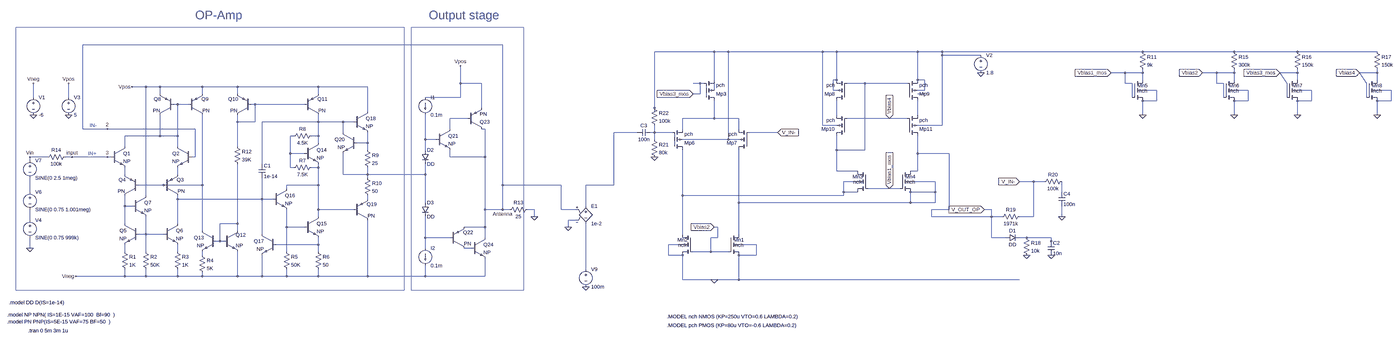
[diagram p0: schematic d (2).asc, whole sheet]
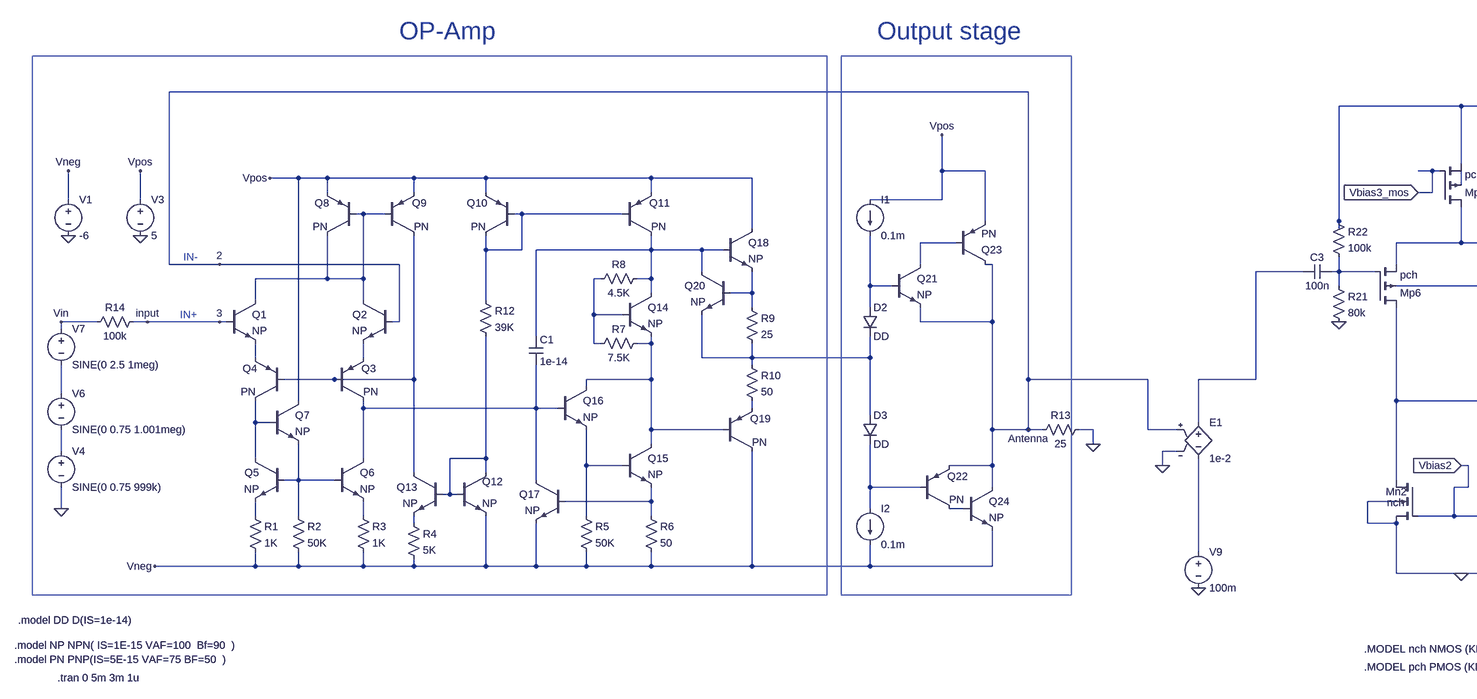
[diagram p1: schematic d (2).asc, part, row 1 of 1, column 1 of 2]
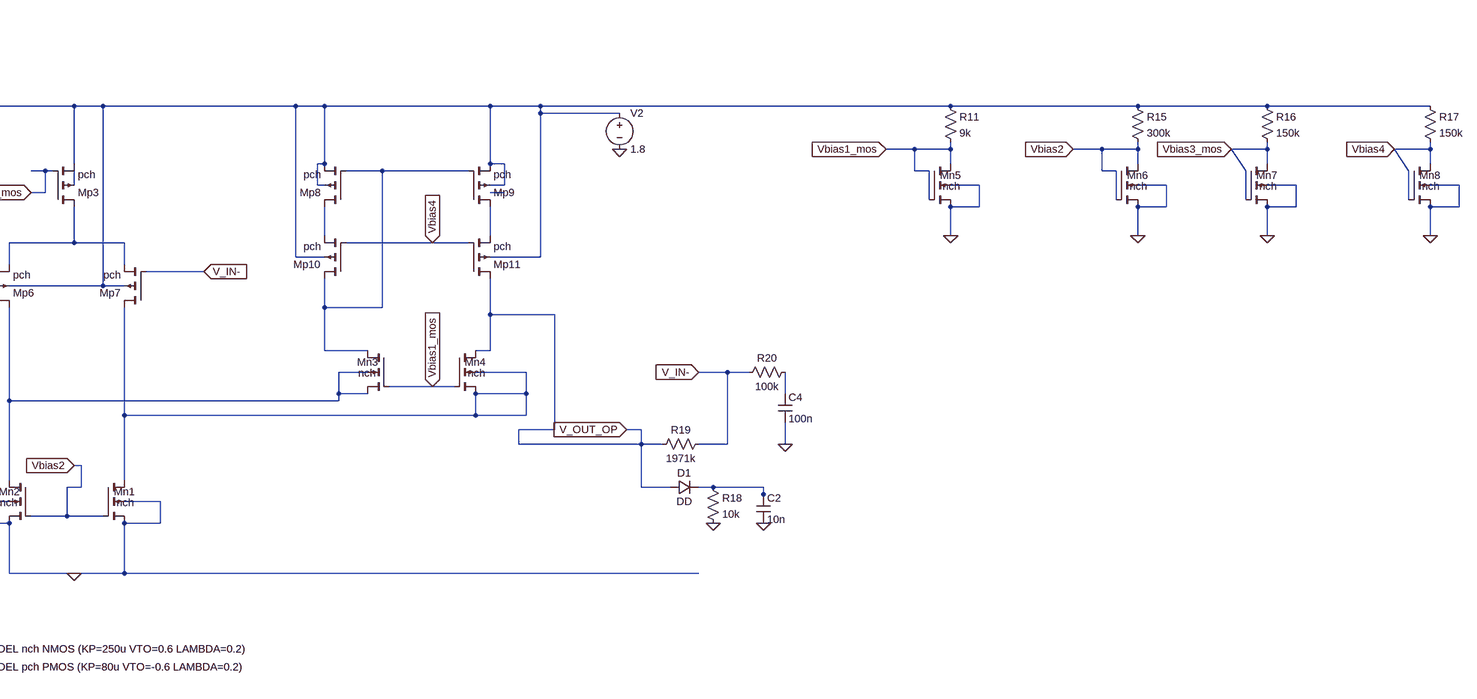
[diagram p2: schematic d (2).asc, part, row 1 of 1, column 2 of 2]
d (2).asc, the LTspice schematic file:
Version 4
SHEET 1 11364 3732
WIRE 2192 -1040 240 -1040
WIRE 3456 -1008 3184 -1008
WIRE 3520 -1008 3456 -1008
WIRE 3952 -1008 3520 -1008
WIRE 4016 -1008 3952 -1008
WIRE 4384 -1008 4016 -1008
WIRE 4496 -1008 4384 -1008
WIRE 5408 -1008 4496 -1008
WIRE 5824 -1008 5408 -1008
WIRE 6112 -1008 5824 -1008
WIRE 6496 -1008 6112 -1008
WIRE 4496 -992 4496 -1008
WIRE 4672 -992 4496 -992
WIRE 5328 -912 5264 -912
WIRE 5408 -912 5408 -928
WIRE 5408 -912 5328 -912
WIRE 5744 -912 5680 -912
WIRE 5824 -912 5824 -928
WIRE 5824 -912 5744 -912
WIRE 6112 -912 6112 -928
WIRE 6112 -912 6032 -912
WIRE 6496 -912 6496 -928
WIRE 6496 -912 6416 -912
WIRE 3456 -880 3456 -1008
WIRE 4016 -880 4016 -1008
WIRE 4016 -880 4000 -880
WIRE 4384 -880 4384 -1008
WIRE 4416 -880 4384 -880
WIRE 5408 -880 5408 -912
WIRE 5824 -880 5824 -912
WIRE 6112 -880 6112 -912
WIRE 6496 -880 6496 -912
WIRE 2000 -864 2000 -944
WIRE 2096 -864 2000 -864
WIRE 3392 -864 3360 -864
WIRE 3408 -864 3392 -864
WIRE 4144 -864 4064 -864
WIRE 4336 -864 4144 -864
WIRE 5328 -864 5328 -912
WIRE 5360 -864 5328 -864
WIRE 5744 -864 5744 -912
WIRE 5776 -864 5744 -864
WIRE 6064 -864 6032 -912
WIRE 6448 -864 6416 -912
WIRE 528 -848 464 -848
WIRE 592 -848 528 -848
WIRE 784 -848 592 -848
WIRE 944 -848 784 -848
WIRE 1312 -848 944 -848
WIRE 1536 -848 1312 -848
WIRE 3456 -832 3456 -864
WIRE 4000 -832 4000 -880
WIRE 4016 -832 4000 -832
WIRE 4416 -832 4416 -880
WIRE 4416 -832 4384 -832
WIRE 5472 -832 5408 -832
WIRE 5888 -832 5824 -832
WIRE 6176 -832 6112 -832
WIRE 6560 -832 6496 -832
WIRE 592 -816 592 -848
WIRE 784 -816 784 -848
WIRE 944 -816 944 -848
WIRE 1312 -816 1312 -848
WIRE 3392 -816 3392 -864
WIRE 3392 -816 3360 -816
WIRE 4416 -816 4384 -816
WIRE 16 -800 16 -864
WIRE 176 -800 176 -864
WIRE 2000 -800 2000 -864
WIRE 2000 -800 1840 -800
WIRE 5360 -800 5360 -864
WIRE 5776 -800 5776 -864
WIRE 6064 -800 6064 -864
WIRE 6448 -800 6448 -864
WIRE 5472 -784 5472 -832
WIRE 5472 -784 5408 -784
WIRE 5888 -784 5888 -832
WIRE 5888 -784 5824 -784
WIRE 6176 -784 6176 -832
WIRE 6176 -784 6112 -784
WIRE 6560 -784 6560 -832
WIRE 6560 -784 6496 -784
WIRE 672 -768 656 -768
WIRE 720 -768 672 -768
WIRE 1024 -768 1008 -768
WIRE 1248 -768 1024 -768
WIRE 2096 -752 2096 -864
WIRE 3184 -752 3184 -1008
WIRE 1536 -736 1536 -848
WIRE 3184 -736 3184 -752
WIRE 4016 -720 4016 -784
WIRE 4384 -720 4384 -784
WIRE 5408 -720 5408 -784
WIRE 5824 -720 5824 -784
WIRE 6112 -720 6112 -784
WIRE 6496 -720 6496 -784
WIRE 2032 -704 1952 -704
WIRE 3456 -704 3456 -784
WIRE 3456 -704 3312 -704
WIRE 3568 -704 3456 -704
WIRE 4256 -704 4064 -704
WIRE 4336 -704 4256 -704
WIRE 944 -688 944 -720
WIRE 1024 -688 1024 -768
WIRE 1024 -688 944 -688
WIRE 1312 -688 1312 -720
WIRE 1312 -688 1056 -688
WIRE 1424 -688 1312 -688
WIRE 1472 -688 1424 -688
WIRE 3952 -672 3952 -1008
WIRE 4016 -672 3952 -672
WIRE 4496 -672 4496 -992
WIRE 4496 -672 4384 -672
WIRE 240 -656 240 -1040
WIRE 352 -656 240 -656
WIRE 752 -656 352 -656
WIRE 1952 -656 1952 -704
WIRE 2112 -656 2096 -656
WIRE 3312 -656 3312 -704
WIRE 3568 -656 3568 -704
WIRE 1424 -640 1424 -688
WIRE 3104 -640 2768 -640
WIRE 3184 -640 3184 -672
WIRE 3184 -640 3168 -640
WIRE 3264 -640 3184 -640
WIRE 3744 -640 3616 -640
WIRE 592 -624 592 -720
WIRE 592 -624 432 -624
WIRE 672 -624 672 -768
WIRE 672 -624 592 -624
WIRE 1200 -624 1184 -624
WIRE 1312 -624 1312 -688
WIRE 1312 -624 1280 -624
WIRE 1840 -608 1840 -720
WIRE 1888 -608 1840 -608
WIRE 3184 -608 3184 -640
WIRE 3520 -608 3520 -1008
WIRE 3520 -608 3312 -608
WIRE 3568 -608 3520 -608
WIRE 1312 -592 1312 -624
WIRE 1536 -592 1536 -640
WIRE 1536 -592 1488 -592
WIRE 432 -576 432 -624
WIRE 672 -576 672 -624
WIRE 944 -576 944 -688
WIRE 1536 -560 1536 -592
WIRE 1840 -560 1840 -608
WIRE 4016 -560 4016 -624
WIRE 4144 -560 4144 -864
WIRE 4144 -560 4016 -560
WIRE 1184 -544 1184 -624
WIRE 1248 -544 1184 -544
WIRE 4384 -544 4384 -624
WIRE 4528 -544 4384 -544
WIRE 80 -528 0 -528
WIRE 192 -528 160 -528
WIRE 352 -528 192 -528
WIRE 368 -528 352 -528
WIRE 752 -528 752 -656
WIRE 752 -528 736 -528
WIRE 1952 -528 1952 -560
WIRE 2112 -528 2112 -656
WIRE 2112 -528 1952 -528
WIRE 0 -512 0 -528
WIRE 1056 -496 1056 -688
WIRE 1184 -480 1184 -544
WIRE 1200 -480 1184 -480
WIRE 1312 -480 1312 -496
WIRE 1312 -480 1280 -480
WIRE 4016 -464 4016 -560
WIRE 4112 -464 4016 -464
WIRE 4384 -464 4384 -544
WIRE 4384 -464 4352 -464
WIRE 432 -448 432 -480
WIRE 672 -448 672 -480
WIRE 1424 -448 1424 -544
WIRE 1536 -448 1536 -480
WIRE 1536 -448 1424 -448
WIRE 1840 -448 1840 -496
WIRE 1840 -448 1536 -448
WIRE 1536 -432 1536 -448
WIRE 4112 -416 4048 -416
WIRE 4464 -416 4352 -416
WIRE 4912 -416 4848 -416
WIRE 4960 -416 4912 -416
WIRE 608 -400 496 -400
WIRE 784 -400 784 -720
WIRE 784 -400 608 -400
WIRE 1312 -400 1312 -480
WIRE 1312 -400 1168 -400
WIRE 2192 -400 2192 -1040
WIRE 2528 -400 2192 -400
WIRE 2768 -400 2768 -640
WIRE 2768 -400 2640 -400
WIRE 1168 -384 1168 -400
WIRE 4256 -384 4160 -384
WIRE 4304 -384 4256 -384
WIRE 0 -368 0 -432
WIRE 4048 -368 4048 -416
WIRE 4112 -368 4048 -368
WIRE 4464 -368 4464 -416
WIRE 4464 -368 4352 -368
WIRE 5040 -368 5040 -416
WIRE 528 -352 528 -848
WIRE 3312 -352 3312 -560
WIRE 4048 -352 4048 -368
WIRE 4048 -352 3312 -352
WIRE 672 -336 672 -352
WIRE 1056 -336 1056 -432
WIRE 1056 -336 672 -336
WIRE 1104 -336 1056 -336
WIRE 1536 -336 1536 -352
WIRE 1840 -320 1840 -448
WIRE 3568 -320 3568 -560
WIRE 4352 -320 4352 -368
WIRE 4352 -320 3568 -320
WIRE 4464 -320 4464 -368
WIRE 4464 -320 4352 -320
WIRE 432 -304 432 -352
WIRE 464 -304 432 -304
WIRE 2640 -304 2640 -400
WIRE 1312 -288 1312 -400
WIRE 1472 -288 1312 -288
WIRE 2112 -288 2112 -528
WIRE 2192 -288 2192 -400
WIRE 2192 -288 2112 -288
WIRE 2224 -288 2192 -288
WIRE 2336 -288 2304 -288
WIRE 2528 -288 2528 -400
WIRE 2592 -288 2528 -288
WIRE 4528 -288 4528 -544
WIRE 4528 -288 4448 -288
WIRE 4720 -288 4688 -288
WIRE 1312 -256 1312 -288
WIRE 2336 -256 2336 -288
WIRE 4448 -256 4448 -288
WIRE 4720 -256 4720 -288
WIRE 4720 -256 4448 -256
WIRE 4768 -256 4720 -256
WIRE 4912 -256 4912 -416
WIRE 4912 -256 4848 -256
WIRE 5040 -256 5040 -304
WIRE 0 -240 0 -288
WIRE 2592 -240 2560 -240
WIRE 432 -224 432 -304
WIRE 672 -224 672 -336
WIRE 944 -224 944 -496
WIRE 944 -224 864 -224
WIRE 1168 -208 1168 -288
WIRE 1248 -208 1168 -208
WIRE 2112 -208 2112 -288
WIRE 2112 -208 2016 -208
WIRE 2560 -208 2560 -240
WIRE 3472 -208 3456 -208
WIRE 784 -192 784 -400
WIRE 944 -192 944 -224
WIRE 528 -176 528 -256
WIRE 528 -176 496 -176
WIRE 608 -176 528 -176
WIRE 1056 -176 1056 -336
WIRE 3312 -176 3312 -352
WIRE 3568 -176 3568 -320
WIRE 1840 -160 1840 -256
WIRE 1952 -160 1840 -160
WIRE 2112 -160 2112 -208
WIRE 3472 -160 3472 -208
WIRE 3472 -160 3440 -160
WIRE 4720 -160 4720 -256
WIRE 4784 -160 4720 -160
WIRE 4880 -160 4848 -160
WIRE 4992 -160 4880 -160
WIRE 864 -144 864 -224
WIRE 864 -144 848 -144
WIRE 880 -144 864 -144
WIRE 4992 -144 4992 -160
WIRE 1312 -128 1312 -160
WIRE 1312 -128 1120 -128
WIRE 3312 -128 3248 -128
WIRE 3648 -128 3568 -128
WIRE 4992 -128 4992 -144
WIRE 0 -112 0 -160
WIRE 1840 -112 1840 -160
WIRE 2048 -112 2016 -112
WIRE 432 -96 432 -128
WIRE 528 -96 528 -176
WIRE 672 -96 672 -128
WIRE 1168 -96 1168 -208
WIRE 1312 -96 1312 -128
WIRE 3440 -96 3440 -160
WIRE 3440 -96 3360 -96
WIRE 3520 -96 3440 -96
WIRE 784 -80 784 -96
WIRE 3248 -80 3248 -128
WIRE 3312 -80 3248 -80
WIRE 3648 -80 3648 -128
WIRE 3648 -80 3568 -80
WIRE 2640 -16 2640 -224
WIRE 432 16 432 -16
WIRE 432 16 208 16
WIRE 528 16 528 -16
WIRE 528 16 432 16
WIRE 672 16 672 -16
WIRE 672 16 528 16
WIRE 784 16 784 0
WIRE 784 16 672 16
WIRE 944 16 944 -96
WIRE 944 16 784 16
WIRE 1056 16 1056 -80
WIRE 1056 16 944 16
WIRE 1168 16 1168 -16
WIRE 1168 16 1056 16
WIRE 1312 16 1312 -16
WIRE 1312 16 1168 16
WIRE 1536 16 1536 -240
WIRE 1536 16 1312 16
WIRE 1840 16 1840 -32
WIRE 1840 16 1536 16
WIRE 2112 16 2112 -64
WIRE 2112 16 1840 16
WIRE 3312 32 3312 -80
WIRE 3456 32 3312 32
WIRE 3568 32 3568 -80
WIRE 3568 32 3456 32
WIRE 4848 32 3568 32
FLAG 352 -528 3
FLAG 352 -656 2
FLAG 16 -720 0
FLAG 176 -720 0
FLAG 176 -864 Vpos
FLAG 16 -864 Vneg
FLAG 0 -112 0
FLAG 2000 -944 Vpos
FLAG 2336 -256 0
FLAG 464 -848 Vpos
FLAG 208 16 Vneg
FLAG 192 -528 input
FLAG 2192 -288 Antenna
FLAG 2640 64 0
FLAG 2560 -208 0
FLAG 3456 32 0
FLAG 3456 -208 Vbias2
IOPIN 3456 -208 In
FLAG 3744 -640 V_IN-
IOPIN 3744 -640 In
FLAG 4672 -912 0
FLAG 4848 -416 V_IN-
IOPIN 4848 -416 In
FLAG 5040 -256 0
FLAG 4688 -288 V_OUT_OP
IOPIN 4688 -288 In
FLAG 3184 -528 0
FLAG 5408 -720 0
FLAG 3360 -816 Vbias3_mos
IOPIN 3360 -816 In
FLAG 5264 -912 Vbias1_mos
IOPIN 5264 -912 In
FLAG 4256 -384 Vbias1_mos
IOPIN 4256 -384 In
FLAG 5824 -720 0
FLAG 5680 -912 Vbias2
IOPIN 5680 -912 In
FLAG 6112 -720 0
FLAG 6032 -912 Vbias3_mos
IOPIN 6032 -912 In
FLAG 6496 -720 0
FLAG 6416 -912 Vbias4
IOPIN 6416 -912 In
FLAG 4256 -704 Vbias4
IOPIN 4256 -704 In
FLAG 4880 -80 0
FLAG 4992 -80 0
FLAG 0 -528 Vin
SYMBOL NPN 368 -576 R0
SYMATTR InstName Q1
SYMATTR Value NP
SYMBOL npn 736 -576 M0
SYMATTR InstName Q2
SYMATTR Value NP
SYMBOL PNP 608 -352 M180
WINDOW 0 60 72 Left 2
WINDOW 3 64 20 Left 2
SYMATTR InstName Q3
SYMATTR Value PN
SYMBOL pnp 496 -352 R180
WINDOW 0 60 72 Left 2
WINDOW 3 64 20 Left 2
SYMATTR InstName Q4
SYMATTR Value PN
SYMBOL npn 496 -224 M0
SYMATTR InstName Q5
SYMATTR Value NP
SYMBOL npn 608 -224 R0
SYMATTR InstName Q6
SYMATTR Value NP
SYMBOL npn 464 -352 R0
SYMATTR InstName Q7
SYMATTR Value NP
SYMBOL pnp 656 -720 R180
WINDOW 0 60 72 Left 2
WINDOW 3 64 20 Left 2
SYMATTR InstName Q8
SYMATTR Value PN
SYMBOL RES 416 -112 R0
SYMATTR InstName R1
SYMATTR Value 1K
SYMBOL res 512 -112 R0
SYMATTR InstName R2
SYMATTR Value 50K
SYMBOL res 656 -112 R0
SYMATTR InstName R3
SYMATTR Value 1K
SYMBOL pnp 720 -720 M180
WINDOW 0 60 72 Left 2
WINDOW 3 64 20 Left 2
SYMATTR InstName Q9
SYMATTR Value PN
SYMBOL pnp 1008 -720 R180
WINDOW 0 60 72 Left 2
WINDOW 3 64 20 Left 2
SYMATTR InstName Q10
SYMATTR Value PN
SYMBOL pnp 1248 -720 M180
WINDOW 0 60 72 Left 2
WINDOW 3 64 20 Left 2
SYMATTR InstName Q11
SYMATTR Value PN
SYMBOL npn 880 -192 R0
WINDOW 0 56 20 Left 2
SYMATTR InstName Q12
SYMATTR Value NP
SYMBOL npn 848 -192 M0
SYMATTR InstName Q13
SYMATTR Value NP
SYMBOL res 768 -96 R0
SYMATTR InstName R4
SYMATTR Value 5K
SYMBOL npn 1248 -592 R0
SYMATTR InstName Q14
SYMATTR Value NP
SYMBOL npn 1248 -256 R0
SYMATTR InstName Q15
SYMATTR Value NP
SYMBOL npn 1104 -384 R0
SYMATTR InstName Q16
SYMATTR Value NP
SYMBOL res 1152 -112 R0
SYMATTR InstName R5
SYMATTR Value 50K
SYMBOL res 1296 -112 R0
SYMATTR InstName R6
SYMATTR Value 50
SYMBOL npn 1120 -176 M0
SYMATTR InstName Q17
SYMATTR Value NP
SYMBOL cap 1040 -496 R0
SYMATTR InstName C1
SYMATTR Value 1e-14
SYMBOL res 1296 -496 R90
WINDOW 0 0 56 VBottom 2
WINDOW 3 32 56 VTop 2
SYMATTR InstName R7
SYMATTR Value 7.5K
SYMBOL res 1296 -640 R90
WINDOW 0 0 56 VBottom 2
WINDOW 3 32 56 VTop 2
SYMATTR InstName R8
SYMATTR Value 4.5K
SYMBOL npn 1472 -736 R0
SYMATTR InstName Q18
SYMATTR Value NP
SYMBOL pnp 1472 -240 M180
WINDOW 0 60 72 Left 2
WINDOW 3 64 20 Left 2
SYMATTR InstName Q19
SYMATTR Value PN
SYMBOL res 1520 -576 R0
SYMATTR InstName R9
SYMATTR Value 25
SYMBOL res 1520 -448 R0
SYMATTR InstName R10
SYMATTR Value 50
SYMBOL npn 1488 -640 M0
SYMATTR InstName Q20
SYMATTR Value NP
SYMBOL res 928 -592 R0
SYMATTR InstName R12
SYMATTR Value 39K
SYMBOL voltage 16 -816 R0
WINDOW 123 0 0 Left 0
WINDOW 39 0 0 Left 0
SYMATTR InstName V1
SYMATTR Value -6
SYMBOL voltage 176 -816 R0
WINDOW 123 0 0 Left 0
WINDOW 39 0 0 Left 0
SYMATTR InstName V3
SYMATTR Value 5
SYMBOL voltage 0 -256 R0
WINDOW 123 0 0 Left 0
WINDOW 39 0 0 Left 0
SYMATTR InstName V4
SYMATTR Value SINE(0 0.75 999k)
SYMBOL voltage 0 -384 R0
WINDOW 123 0 0 Left 0
WINDOW 39 0 0 Left 0
SYMATTR InstName V6
SYMATTR Value SINE(0 0.75 1.001meg)
SYMBOL voltage 0 -528 R0
WINDOW 123 0 0 Left 0
WINDOW 39 0 0 Left 0
SYMATTR InstName V7
SYMATTR Value SINE(0 2.5 1meg)
SYMBOL PNP 1952 -112 M180
WINDOW 0 60 72 Left 2
WINDOW 3 64 20 Left 2
SYMATTR InstName Q22
SYMATTR Value PN
SYMBOL NPN 2048 -160 R0
SYMATTR InstName Q24
SYMATTR Value NP
SYMBOL res 2320 -304 R90
WINDOW 0 0 56 VBottom 2
WINDOW 3 32 56 VTop 2
SYMATTR InstName R13
SYMATTR Value 25
SYMBOL e 2640 -320 R0
SYMATTR InstName E1
SYMATTR Value 1e-2
SYMBOL voltage 2640 -32 R0
WINDOW 123 0 0 Left 0
WINDOW 39 0 0 Left 0
SYMATTR InstName V9
SYMATTR Value 100m
SYMBOL res 176 -544 R90
WINDOW 0 0 56 VBottom 2
WINDOW 3 32 56 VTop 2
SYMATTR InstName R14
SYMATTR Value 100k
SYMBOL pmos4 3408 -784 M180
SYMATTR InstName Mp3
SYMATTR Value pch
SYMATTR Value2 l=2u w=10u m=1
SYMBOL pmos4 3264 -560 M180
SYMATTR InstName Mp6
SYMATTR Value pch
SYMATTR Value2 l=0.8u w=300u m=20
SYMBOL pmos4 3616 -560 R180
SYMATTR InstName Mp7
SYMATTR Value pch
SYMATTR Value2 l=0.8u w=300u m=20
SYMBOL nmos4 3520 -176 R0
WINDOW 0 24 26 Left 2
WINDOW 3 30 50 Left 2
SYMATTR InstName Mn1
SYMATTR Value nch
SYMATTR Value2 l=0.8u w=430u m=10
SYMBOL nmos4 3360 -176 M0
WINDOW 0 24 26 Left 2
WINDOW 3 30 50 Left 2
SYMATTR InstName Mn2
SYMATTR Value nch
SYMATTR Value2 l=0.8u w=430u m=10
SYMBOL pmos4 4064 -784 R180
SYMATTR InstName Mp8
SYMATTR Value pch
SYMATTR Value2 l=0.8u w=550u m=1
SYMBOL pmos4 4336 -784 M180
SYMATTR InstName Mp9
SYMATTR Value pch
SYMATTR Value2 l=0.8u w=550u m=1
SYMBOL pmos4 4064 -624 R180
SYMATTR InstName Mp10
SYMATTR Value pch
SYMATTR Value2 l=0.8u w=550u m=1
SYMBOL pmos4 4336 -624 M180
SYMATTR InstName Mp11
SYMATTR Value pch
SYMATTR Value2 l=0.8u w=550u m=1
SYMBOL nmos4 4160 -464 M0
WINDOW 0 24 26 Left 2
WINDOW 3 30 50 Left 2
SYMATTR InstName Mn3
SYMATTR Value nch
SYMATTR Value2 l=2u w=100u m=1
SYMBOL nmos4 4304 -464 R0
WINDOW 0 24 26 Left 2
WINDOW 3 30 50 Left 2
SYMATTR InstName Mn4
SYMATTR Value nch
SYMATTR Value2 l=2u w=100u m=1
SYMBOL voltage 4672 -1008 R0
WINDOW 123 0 0 Left 0
WINDOW 39 0 0 Left 0
SYMATTR InstName V2
SYMATTR Value 1.8
SYMBOL res 4864 -272 R90
WINDOW 0 0 56 VBottom 2
WINDOW 3 32 56 VTop 2
SYMATTR InstName R19
SYMATTR Value 1971k
SYMBOL res 4944 -400 R270
WINDOW 0 32 56 VTop 2
WINDOW 3 0 56 VBottom 2
SYMATTR InstName R20
SYMATTR Value 100k
SYMBOL res 3168 -624 R0
SYMATTR InstName R21
SYMATTR Value 80k
SYMBOL res 3168 -768 R0
SYMATTR InstName R22
SYMATTR Value 100k
SYMBOL cap 3168 -656 R90
WINDOW 0 0 32 VBottom 2
WINDOW 3 32 32 VTop 2
SYMATTR InstName C3
SYMATTR Value 100n
SYMBOL cap 5024 -368 R0
SYMATTR InstName C4
SYMATTR Value 100n
SYMBOL res 5392 -1024 R0
SYMATTR InstName R11
SYMATTR Value 9k
SYMBOL nmos4 5360 -880 R0
WINDOW 0 24 26 Left 2
WINDOW 3 30 50 Left 2
SYMATTR InstName Mn5
SYMATTR Value nch
SYMATTR Value2 l=1u w=1u m=1
SYMBOL res 5808 -1024 R0
SYMATTR InstName R15
SYMATTR Value 300k
SYMBOL nmos4 5776 -880 R0
WINDOW 0 24 26 Left 2
WINDOW 3 30 50 Left 2
SYMATTR InstName Mn6
SYMATTR Value nch
SYMATTR Value2 l=1u w=200u m=3
SYMBOL res 6096 -1024 R0
SYMATTR InstName R16
SYMATTR Value 150k
SYMBOL nmos4 6064 -880 R0
WINDOW 0 24 26 Left 2
WINDOW 3 30 50 Left 2
SYMATTR InstName Mn7
SYMATTR Value nch
SYMATTR Value2 l=1u w=1u m=1
SYMBOL res 6480 -1024 R0
SYMATTR InstName R17
SYMATTR Value 150k
SYMBOL nmos4 6448 -880 R0
WINDOW 0 24 26 Left 2
WINDOW 3 30 50 Left 2
SYMATTR InstName Mn8
SYMATTR Value nch
SYMATTR Value2 l=1u w=1u m=1
SYMBOL res 4864 -176 R0
SYMATTR InstName R18
SYMATTR Value 10k
SYMBOL cap 4976 -144 R0
SYMATTR InstName C2
SYMATTR Value 10n
SYMBOL diode 4784 -144 R270
WINDOW 0 32 32 VTop 2
WINDOW 3 0 32 VBottom 2
SYMATTR InstName D1
SYMATTR Value DD
SYMBOL npn 1888 -656 R0
SYMATTR InstName Q21
SYMATTR Value NP
SYMBOL pnp 2032 -656 M180
SYMATTR InstName Q23
SYMATTR Value PN
SYMBOL current 1840 -800 R0
WINDOW 123 0 0 Left 0
WINDOW 39 0 0 Left 0
SYMATTR InstName I1
SYMATTR Value 0.1m
SYMBOL current 1840 -112 R0
WINDOW 123 0 0 Left 0
WINDOW 39 0 0 Left 0
SYMATTR InstName I2
SYMATTR Value 0.1m
SYMBOL diode 1824 -560 R0
SYMATTR InstName D2
SYMATTR Value DD
SYMBOL diode 1824 -320 R0
SYMATTR InstName D3
SYMATTR Value DD
TEXT -8 264 Left 2 !.tran 0 5m 3m 1u
TEXT -104 192 Left 2 !.model NP NPN( IS=1E-15 VAF=100  Bf=90  )\n.model PN PNP(IS=5E-15 VAF=75 BF=50  )
TEXT 3240 200 Left 2 !.MODEL nch NMOS (KP=250u VTO=0.6 LAMBDA=0.2)
TEXT 3240 240 Left 2 !.MODEL pch PMOS (KP=80u VTO=-0.6 LAMBDA=0.2)
TEXT 264 -544 Left 2 ;IN+
TEXT 272 -672 Left 2 ;IN-
TEXT 752 -1176 Left 5 ;OP-Amp
TEXT 1856 -1176 Left 5 ;Output stage
TEXT -96 136 Left 2 !.model DD D(IS=1e-14)
RECTANGLE Normal 1776 80 2288 -1120
RECTANGLE Normal -64 80 1744 -1120

The netlist it stands for:
* d (2).asc
Q1 N005 input N018 0 NP
Q2 N005 Antenna N019 0 NP
Q3 N026 N023 N019 0 PN
Q4 N028 N023 N018 0 PN
Q5 N028 N032 N037 0 NP
Q6 N026 N032 N038 0 NP
Q7 Vpos N028 N032 0 NP
Q8 N005 N005 Vpos 0 PN
R1 N037 Vneg 1K
R2 N032 Vneg 50K
R3 N038 Vneg 1K
Q9 N023 N005 Vpos 0 PN
Q10 N006 N006 Vpos 0 PN
Q11 N011 N006 Vpos 0 PN
Q12 N030 N030 Vneg 0 NP
Q13 N023 N030 N039 0 NP
R4 N039 Vneg 5K
Q14 N011 N014 N017 0 NP
Q15 N017 N031 N035 0 NP
Q16 N017 N026 N031 0 NP
R5 N031 Vneg 50K
R6 N035 Vneg 50
Q17 N026 N035 Vneg 0 NP
C1 N011 N026 1e-14
R7 N017 N014 7.5K
R8 N011 N014 4.5K
Q18 Vpos N011 N016 0 NP
Q19 Vneg N017 N027 0 PN
R9 N016 N020 25
R10 N020 N027 50
Q20 N011 N016 N020 0 NP
R12 N006 N030 39K
V1 Vneg 0 -6
V3 Vpos 0 5
V4 N029 0 SINE(0 0.75 999k)
V6 N024 N029 SINE(0 0.75 1.001meg)
V7 Vin N024 SINE(0 2.5 1meg)
Q22 N036 N033 Antenna 0 PN
Q24 Antenna N036 Vneg 0 NP
R13 0 Antenna 25
E1 N012 N040 Antenna 0 1e-2
V9 N040 0 100m
R14 input Vin 100k
Mp3 N010 Vbias3_mos N001 N003 pch l=2u w=10u m=1
Mp6 N021 N013 N010 N001 pch l=0.8u w=300u m=20
Mp7 N022 V_IN- N010 N001 pch l=0.8u w=300u m=20
Mn1 N022 Vbias2 0 0 nch l=0.8u w=430u m=10
Mn2 N021 Vbias2 0 0 nch l=0.8u w=430u m=10
Mp8 N007 N002 N001 N001 pch l=0.8u w=550u m=1
Mp9 N008 N002 N001 N001 pch l=0.8u w=550u m=1
Mp10 N002 Vbias4 N007 N001 pch l=0.8u w=550u m=1
Mp11 V_OUT_OP Vbias4 N008 N001 pch l=0.8u w=550u m=1
Mn3 N002 Vbias1_mos N021 N021 nch l=2u w=100u m=1
Mn4 V_OUT_OP Vbias1_mos N022 N022 nch l=2u w=100u m=1
V2 N001 0 1.8
R19 V_IN- V_OUT_OP 1971k
R20 V_IN- N025 100k
R21 N013 0 80k
R22 N001 N013 100k
C3 N013 N012 100n
C4 N025 0 100n
R11 N001 Vbias1_mos 9k
Mn5 Vbias1_mos Vbias1_mos 0 0 nch l=1u w=1u m=1
R15 N001 Vbias2 300k
Mn6 Vbias2 Vbias2 0 0 nch l=1u w=200u m=3
R16 N001 Vbias3_mos 150k
Mn7 Vbias3_mos Vbias3_mos 0 0 nch l=1u w=1u m=1
R17 N001 Vbias4 150k
Mn8 Vbias4 Vbias4 0 0 nch l=1u w=1u m=1
R18 N034 0 10k
C2 N034 0 10n
D1 V_OUT_OP N034 DD
Q21 N009 N015 Antenna 0 NP
Q23 Antenna N009 Vpos 0 PN
I1 Vpos N015 0.1m
I2 N033 Vneg 0.1m
D2 N015 N020 DD
D3 N020 N033 DD
.model D D
.lib standard.dio
.model NPN NPN
.model PNP PNP
.lib standard.bjt
.model NMOS NMOS
.model PMOS PMOS
.lib standard.mos
.tran 0 5m 3m 1u
.model NP NPN( IS=1E-15 VAF=100  Bf=90  )
.model PN PNP(IS=5E-15 VAF=75 BF=50  )
.MODEL nch NMOS (KP=250u VTO=0.6 LAMBDA=0.2)
.MODEL pch PMOS (KP=80u VTO=-0.6 LAMBDA=0.2)
* IN+
* IN-
* OP-Amp
* Output stage
.model DD D(IS=1e-14)
.backanno
.end